# EAGLE design SensorJumper2768 (EAGLE 9.6.2)
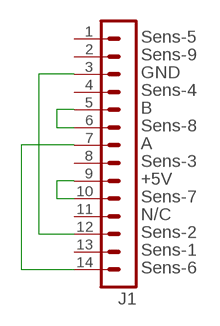
[diagram p0: schematic, sheet 1]

## Parts
J1  CONN-14-1.27X2  [CONN-1.27X2-14]

## Nets
N$1: J1.3 J1.12
N$2: J1.7 J1.14
N$3: J1.9 J1.10
N$4: J1.5 J1.6
Unconnected: J1.1 J1.2 J1.4 J1.8 J1.11 J1.13

## Notes on the sheet
- Sens-5
- Sens-9
- GND
- Sens-4
- B
- Sens-8
- A
- Sens-3
- +5V
- Sens-7
- N/C
- Sens-2
- Sens-1
- Sens-6

## Library data of the parts
J1 = Connectors:CONN-14

## Board
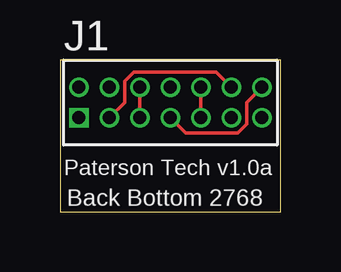
[diagram p1: board, top side]
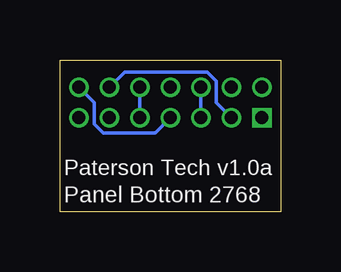
[diagram p2: board, bottom side, seen from below]

Size 9.19 x 6.35 mm. Coordinates in mm from the lower left corner, seen from the top.
Outline: 0,0 9.19,0 9.19,6.35 0,6.35 0,0
Copper layers (1*16): Top 0.035559375mm / dielectric 1.6mm / Bottom 0.035559375mm
Design rules "oshpark-2layer": minimum track width 6mil, minimum drill 10mil, track to track 6mil, track to pad 6mil, pad to pad 6mil, via to via 6mil, smd to smd 6mil, copper to edge 15mil, drill to drill 6mil, minimum pad ring 5mil, minimum via ring 5mil, stop-mask expansion 2.5mil, vias tented up to drill 0mil, thermal gap 7mil

### Footprints (pad centres in the part's own frame; a part is rotated, then mirrored left to right if it is on the bottom)
CONN-1.27X2-14 = drill 0.542 square: 1 -1.905,-0.635 | drill 0.542: 2 -1.905,0.635; 3 -0.635,-0.635; 4 -0.635,0.635; 5 0.635,-0.635; 6 0.635,0.635; 7 1.905,-0.635; 8 1.905,0.635; 9 3.175,-0.635; 10 3.175,0.635; 11 4.445,-0.635; 12 4.445,0.635; 13 5.715,-0.635; 14 5.715,0.635

### Placement (x,y rotation side)
J1  2.69,4.57 0 top

### Tracks (layer width: path | path; a pad name or v marks a point on that pad's centre or on a via)
N$1
  Top 0.152: J1.3 2.69,4.57 2.69,5.47 3.06,5.84 6.5,5.84 J1.12
  Bottom 0.152: J1.3 2.69,4.57 2.69,5.47 3.06,5.84 6.5,5.84 J1.12
N$2
  Top 0.152: J1.14 7.77,4.57 7.77,3.67 7.4,3.3 5.23,3.3 J1.7
  Bottom 0.152: J1.7 5.23,3.3 7.4,3.3 7.77,3.67 7.77,4.57 J1.14
N$3
  Top 0.152: J1.10 J1.9
  Bottom 0.152: J1.10 J1.9
N$4
  Top 0.152: J1.6 J1.5
  Bottom 0.152: J1.5 J1.6

### Text on the board
tPlace: Paterson Tech v1.0a | Back Bottom 2768
bPlace: Paterson Tech v1.0a | Panel Bottom 2768